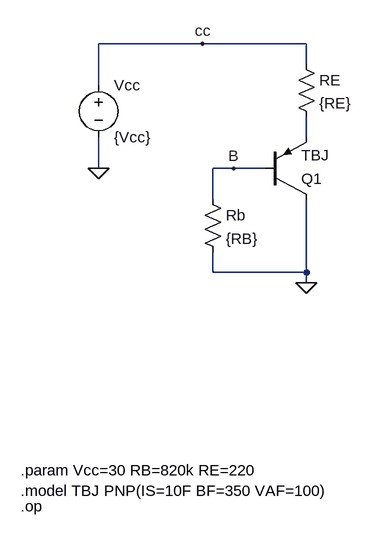
[diagram p0: schematic TBJPNP03CAop.asc]
TBJPNP03CAop.asc, the LTspice schematic file:
Version 4
SHEET 1 1608 1076
WIRE 128 -16 -32 -16
WIRE 288 -16 128 -16
WIRE 288 16 288 -16
WIRE -32 48 -32 -16
WIRE 288 128 288 96
WIRE -32 176 -32 128
WIRE 176 176 144 176
WIRE 224 176 176 176
WIRE 144 224 144 176
WIRE 144 336 144 304
WIRE 288 336 288 224
WIRE 288 336 144 336
WIRE 288 352 288 336
FLAG -32 176 0
FLAG 288 352 0
FLAG 128 -16 cc
FLAG 176 176 B
SYMBOL res 128 208 R0
SYMATTR InstName Rb
SYMATTR Value {RB}
SYMBOL voltage -32 32 R0
WINDOW 123 0 0 Left 0
WINDOW 39 0 0 Left 0
SYMATTR InstName Vcc
SYMATTR Value {Vcc}
SYMBOL res 272 0 R0
SYMATTR InstName RE
SYMATTR Value {RE}
SYMBOL pnp 224 224 M180
SYMATTR InstName Q1
SYMATTR Value TBJ
TEXT -152 640 Left 2 !.param Vcc=30 RB=820k RE=220
TEXT -152 696 Left 2 !.op
TEXT -152 672 Left 2 !.model TBJ PNP(IS=10F BF=350 VAF=100)

The netlist it stands for:
* TBJPNP03CAop.asc
Rb B 0 {RB}
Vcc cc 0 {Vcc}
RE cc N001 {RE}
Q1 0 B N001 0 TBJ
.model NPN NPN
.model PNP PNP
.lib standard.bjt
.param Vcc=30 RB=820k RE=220
.op
.model TBJ PNP(IS=10F BF=350 VAF=100)
.backanno
.end